# EAGLE schematic LMP848x Breakout v1.3 (EAGLE 8.3.2)
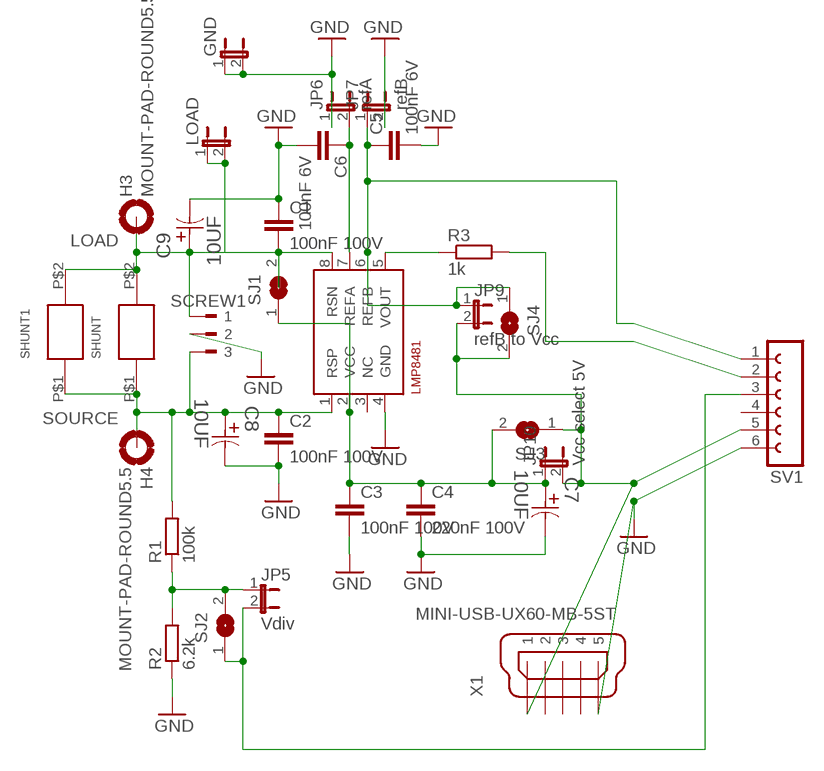
[diagram p0: schematic, sheet 1]

## Parts
C1  100nF 100V  C-EUC0805  [C0805]
C2  100nF 100V  C-EUC0805  [C0805]
C3  100nF 100V  C-EUC0805  [C0805]
C4  220nF 100V  C-EUC0805  [C0805]
C5  100nF 6V  C-EUC0805  [C0805]
C6  100nF 6V  C-EUC0805  [C0805]
C7  10UF  ECA1HM100I-D5XP2.5  [CAPPR250-500X1100]
C8  10UF  ECA1HM100I-D5XP2.5  [CAPPR250-500X1100]
C9  10UF  ECA1HM100I-D5XP2.5  [CAPPR250-500X1100]
GND  JP1E  [JP1]
H3  MOUNT-PAD-ROUND5.5  [5,5-PAD]
H4  MOUNT-PAD-ROUND5.5  [5,5-PAD]
JP5  Vdiv  JP1E  [JP1]
JP6  refA  JP1E  [JP1]
JP7  refB  JP1E  [JP1]
JP9  refB to Vcc  JP1E  [JP1]
JP10  Vcc select 5V  JP1E  [JP1]
LMP848X  LMP8481-H  [S-PDSO-G08]
LOAD  JP1E  [JP1]
R1  100k  R-EU_0207/7  [0207/7]
R2  6.2k  R-EU_0204/5  [0204/5]
R3  1k  R-EU_0204/5  [0204/5]
SCREW1  180-3  [180-3]
SHUNT  EBW_SERIES_15.2MM  [EBW_SERIES_15.2MM]
SHUNT1  EBW_SERIES_15.2MM  [EBW_SERIES_15.2MM]
SJ1  SJ  [SJ]
SJ2  SJ  [SJ]
SJ3  SJ  [SJ]
SJ4  SJ  [SJ]
SV1  FE06-1  [FE06]
X1  MINI-USB-UX60-MB-5ST  [UX60-MB-5ST]

## Nets
GND: C1.1 C2.2 C3.2 C4.2 C5.2 C6.2 C7.2 C8.2 C9.2 GND.1 GND.2 JP6.1 JP7.2 LMP848X.4(GND) R2.1 SCREW1.2 SV1.6 X1.5
LOAD: C1.2 C9.1 H3.B5,5(MOUNT) LMP848X.8(RSN) LOAD.1 LOAD.2 SCREW1.1 SHUNT1.P$2 SHUNT.P$2 SJ1.2
N$1: C3.1 C4.1 C7.1 JP10.1 LMP848X.2(VCC) SJ1.1 SJ3.2
N$2: LMP848X.5(VOUT) R3.1
N$3: C5.1 JP7.1 JP9.1 LMP848X.6(REFB) SJ4.1 SV1.1
N$4: JP9.2 JP10.2 SJ3.1 SJ4.2 SV1.5 X1.1
N$5: R3.2 SV1.2
N$6: C6.1 JP6.2 LMP848X.7(REFA)
N$7: JP5.1 R1.1 R2.2 SJ2.2
SOURCE: C2.1 C8.1 H4.B5,5(MOUNT) LMP848X.1(RSP) R1.2 SCREW1.3 SHUNT1.P$1 SHUNT.P$1
VDIV: JP5.2 SJ2.1 SV1.3
Unconnected: LMP848X.3(NC) SV1.4 X1.2 X1.3 X1.4

## Library data of the parts
C1-C6 = rcl:C-EU: CAPACITOR, European symbol
C7-C9 = Panasonic-ECA_00:ECA: Aluminum Electrolytic Capacitors/Radial Lead Type/Series: M/Type: A; MPN: ECA1HM100I; OC_FARNELL: 2282220; OC_NEWARK: 48W7714; PACKAGE: Radial Lead-TH; SUPPLIER: PANASONIC; TOLERANCE: ±20 %; VOLTAGERATING: 50V
GND JP5-JP7 JP9 JP10 LOAD = jumper:JP1E: JUMPER
H3 H4 = holes:MOUNT-PAD-ROUND: MOUNTING PAD, round
LMP848X = LMP8481:LMP8481: LMP8481MM-H/NOPB 100V/V
R1-R3 = rcl:R-EU_: RESISTOR, European symbol
SCREW1 = con-weidmueller-sl35:180-3: WEIDMUELLER CLAMP CONNECTOR; OC_FARNELL: unknown; OC_NEWARK: unknown
SHUNT SHUNT1 = EBW series shunt:EBW_SERIES_15.2MM
SJ1-SJ4 = jumper:SJ: SMD solder JUMPER
SV1 = con-lsta:FE06-1: FEMALE HEADER; OC_FARNELL: unknown; OC_NEWARK: unknown
X1 = con-hirose:MINI-USB-: MINI USB Connector Source: http://www.hirose.co.jp/cataloge_hp/e24000019.pdf; OC_FARNELL: unknown; OC_NEWARK: unknown

## Net classes
2 thin_power: width 0.254 mm